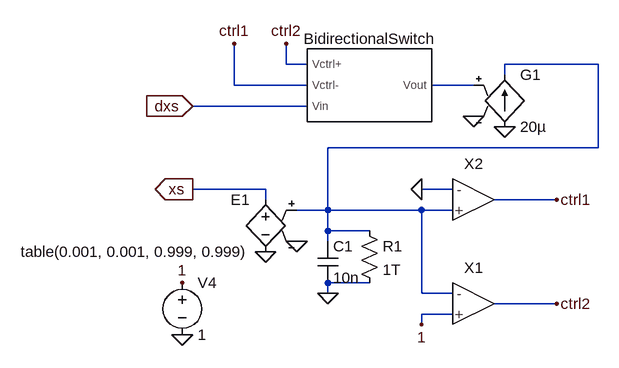
[diagram p0: schematic xs.asc]
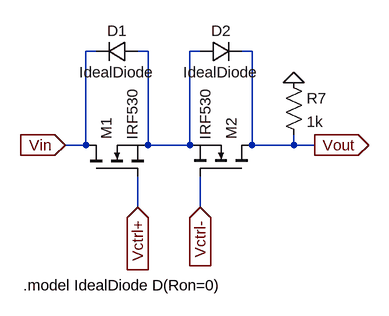
[diagram p1: sub-circuit bidirectional_switch_pm.asc]
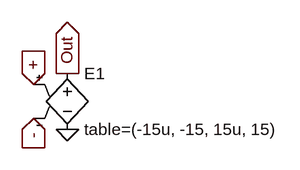
[diagram p2: sub-circuit idealopamp_15.asc]
xs.asc, the LTspice schematic file:
Version 4
SHEET 1 1048 680
WIRE 96 -64 96 -96
WIRE 128 -64 96 -64
WIRE 576 -64 432 -64
WIRE 432 -48 432 -64
WIRE 16 -32 16 -96
WIRE 128 -32 16 -32
WIRE 384 -32 320 -32
WIRE 128 0 -48 0
WIRE 576 64 576 -64
WIRE 576 64 160 64
WIRE 64 128 -48 128
WIRE 352 128 304 128
WIRE 64 144 64 128
WIRE 512 144 416 144
WIRE 160 160 160 64
WIRE 160 160 112 160
WIRE 304 160 160 160
WIRE 352 160 304 160
WIRE 160 192 160 160
WIRE 224 192 160 192
WIRE 160 208 160 192
WIRE 224 272 160 272
WIRE 160 288 160 272
WIRE 304 288 304 160
WIRE 352 288 304 288
WIRE 512 304 416 304
WIRE 352 320 304 320
WIRE 304 336 304 320
FLAG 160 288 0
FLAG -64 352 0
FLAG -64 272 1
FLAG 512 144 ctrl1
FLAG 512 304 ctrl2
FLAG 16 -96 ctrl1
FLAG 96 -96 ctrl2
FLAG 304 336 1
FLAG 304 128 0
FLAG -48 0 dxs
IOPIN -48 0 In
FLAG -48 128 xs
IOPIN -48 128 Out
FLAG 384 16 0
FLAG 432 32 0
FLAG 112 208 0
FLAG 64 224 0
SYMBOL cap 144 208 R0
SYMATTR InstName C1
SYMATTR Value 10n
SYMBOL voltage -64 256 R0
WINDOW 123 0 0 Left 0
WINDOW 39 0 0 Left 0
SYMATTR InstName V4
SYMATTR Value 1
SYMBOL bidirectional_switch_pm 224 -32 R0
SYMATTR InstName BidirectionalSwitch
SYMBOL g 432 -64 R0
SYMATTR InstName G1
SYMATTR Value 20µ
SYMBOL e 64 128 M0
SYMATTR InstName E1
SYMATTR Value table(0.001, 0.001, 0.999, 0.999)
SYMBOL IdealOpAmp_15 384 304 R0
SYMATTR InstName X1
SYMBOL IdealOpAmp_15 384 144 R0
SYMATTR InstName X2
SYMBOL res 208 176 R0
SYMATTR InstName R1
SYMATTR Value 1T

bidirectional_switch_pm.asc, the sub-circuit schematic file:
Version 4
SHEET 1 880 680
WIRE 96 0 80 0
WIRE 176 0 160 0
WIRE 256 0 240 0
WIRE 336 0 320 0
WIRE 80 144 80 0
WIRE 80 144 48 144
WIRE 176 144 176 0
WIRE 240 144 240 0
WIRE 240 144 176 144
WIRE 336 144 336 0
WIRE 400 144 400 128
WIRE 400 144 336 144
WIRE 432 144 400 144
WIRE 160 240 160 192
WIRE 256 240 256 192
FLAG 48 144 Vin
IOPIN 48 144 In
FLAG 432 144 Vout
IOPIN 432 144 Out
FLAG 160 240 Vctrl+
IOPIN 160 240 In
FLAG 256 240 Vctrl-
IOPIN 256 240 In
FLAG 400 48 0
SYMBOL nmos 80 192 R270
SYMATTR InstName M1
SYMATTR Value IRF530
SYMBOL nmos 336 192 M270
SYMATTR InstName M2
SYMATTR Value IRF530
SYMBOL diode 160 -16 R90
WINDOW 0 0 32 VBottom 2
WINDOW 3 32 32 VTop 2
SYMATTR InstName D1
SYMATTR Value IdealDiode
SYMBOL diode 256 16 R270
WINDOW 0 32 32 VTop 2
WINDOW 3 0 32 VBottom 2
SYMATTR InstName D2
SYMATTR Value IdealDiode
SYMBOL res 384 32 R0
SYMATTR InstName R7
SYMATTR Value 1k
TEXT -16 360 Left 2 !.model IdealDiode D(Ron=0)

idealopamp_15.asc, the sub-circuit schematic file:
Version 4
SHEET 1 880 680
FLAG 208 192 0
FLAG 160 128 +
IOPIN 160 128 In
FLAG 160 176 -
IOPIN 160 176 In
FLAG 208 112 Out
IOPIN 208 112 Out
SYMBOL e 208 96 R0
SYMATTR InstName E1
SYMATTR Value table=(-15u, -15, 15u, 15)

The netlist it stands for:
* xs.asc
C1 N001 0 10n
V4 1 0 1
XBidirectionalSwitch ctrl2 ctrl1 dxs N002 bidirectional_switch_pm
G1 0 N001 N002 0 20µ
E1 xs 0 N001 0 table(0.001, 0.001, 0.999, 0.999)
XX1 1 N001 ctrl2 idealopamp_15
XX2 N001 0 ctrl1 idealopamp_15
R1 N001 0 1T

* block symbol definitions
.subckt bidirectional_switch_pm Vctrl+ Vctrl- Vin Vout
M1 Vin Vctrl+ N001 N001 IRF530
M2 Vout Vctrl- N001 N001 IRF530
D1 N001 Vin IdealDiode
D2 N001 Vout IdealDiode
R7 0 Vout 1k
.model IdealDiode D(Ron=0)
.ends bidirectional_switch_pm

.subckt idealopamp_15 + - Out
E1 Out 0 + - table=(-15u, -15, 15u, 15)
.ends idealopamp_15

.model D D
.lib standard.dio
.model NMOS NMOS
.model PMOS PMOS
.lib standard.mos
.backanno
.end